# EAGLE schematic iMX233-OLinuXino_Maxi_Rev_B (EAGLE 4.16)
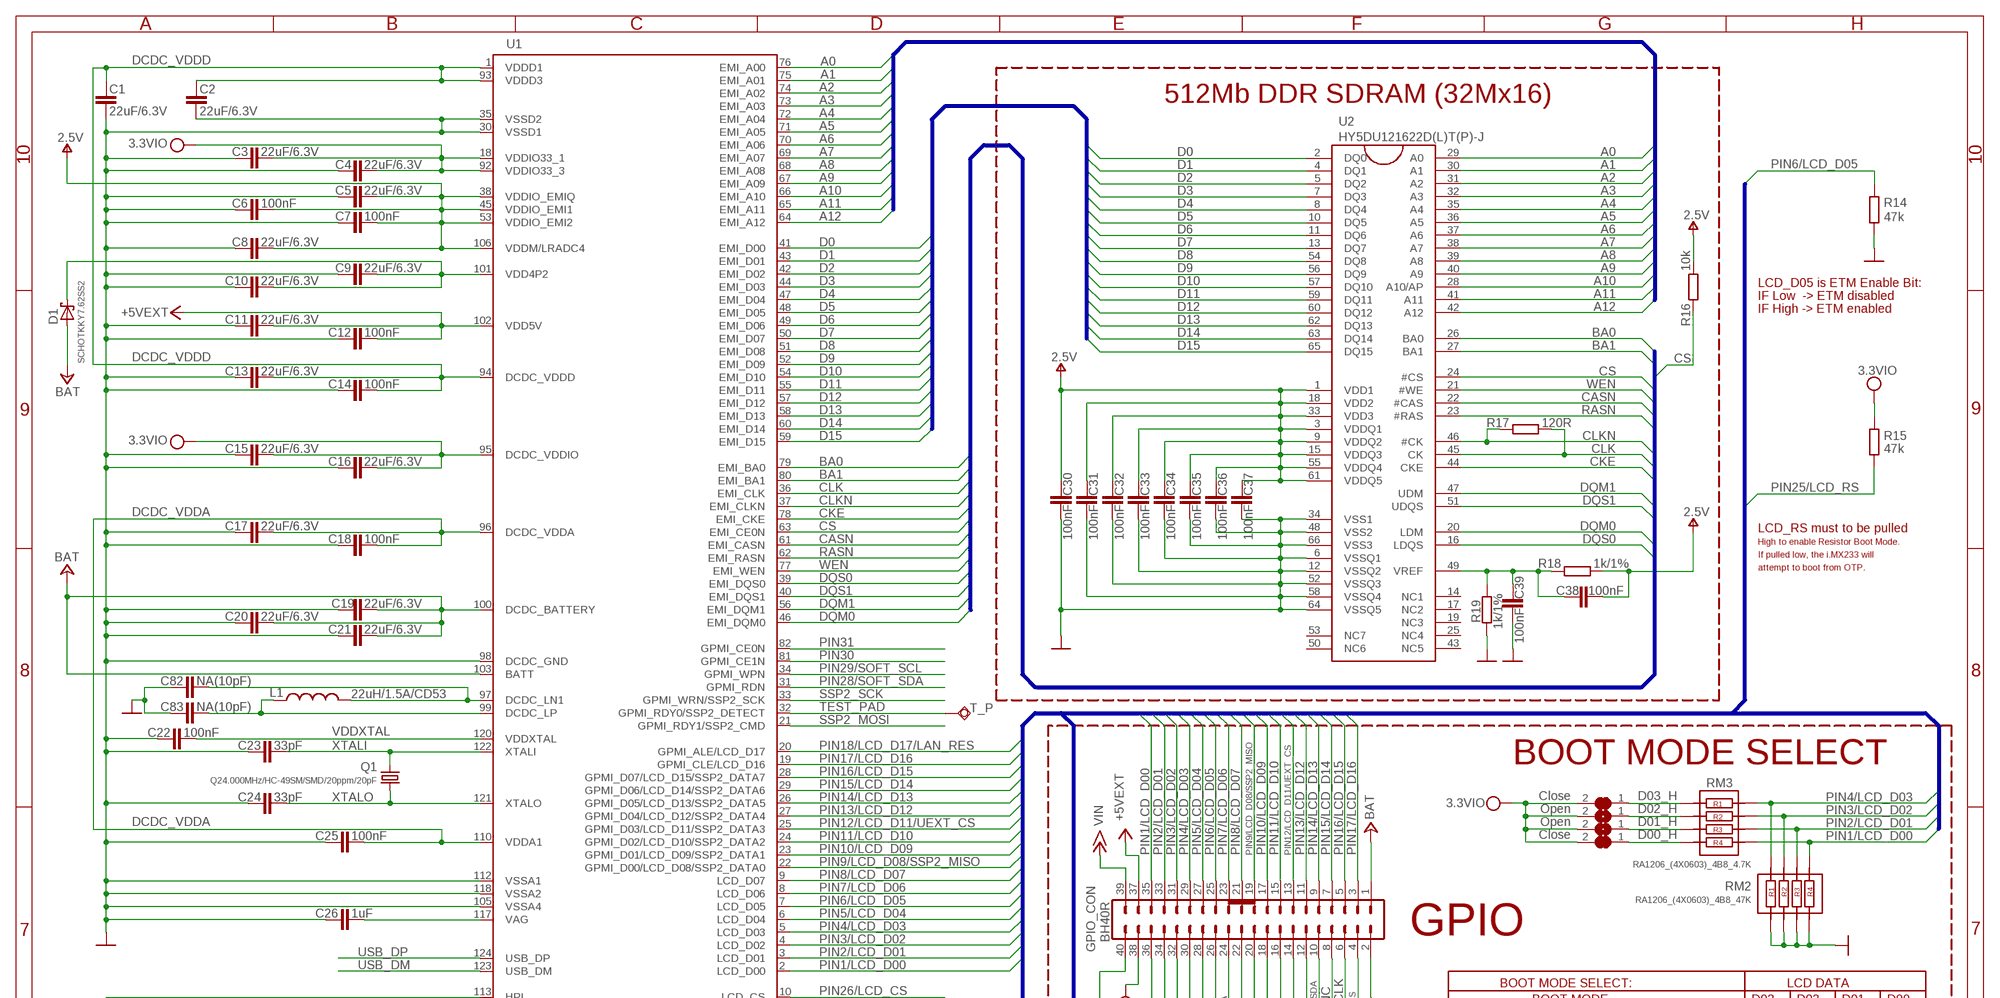
[diagram p0: schematic, sheet 1, part 1 of 2]
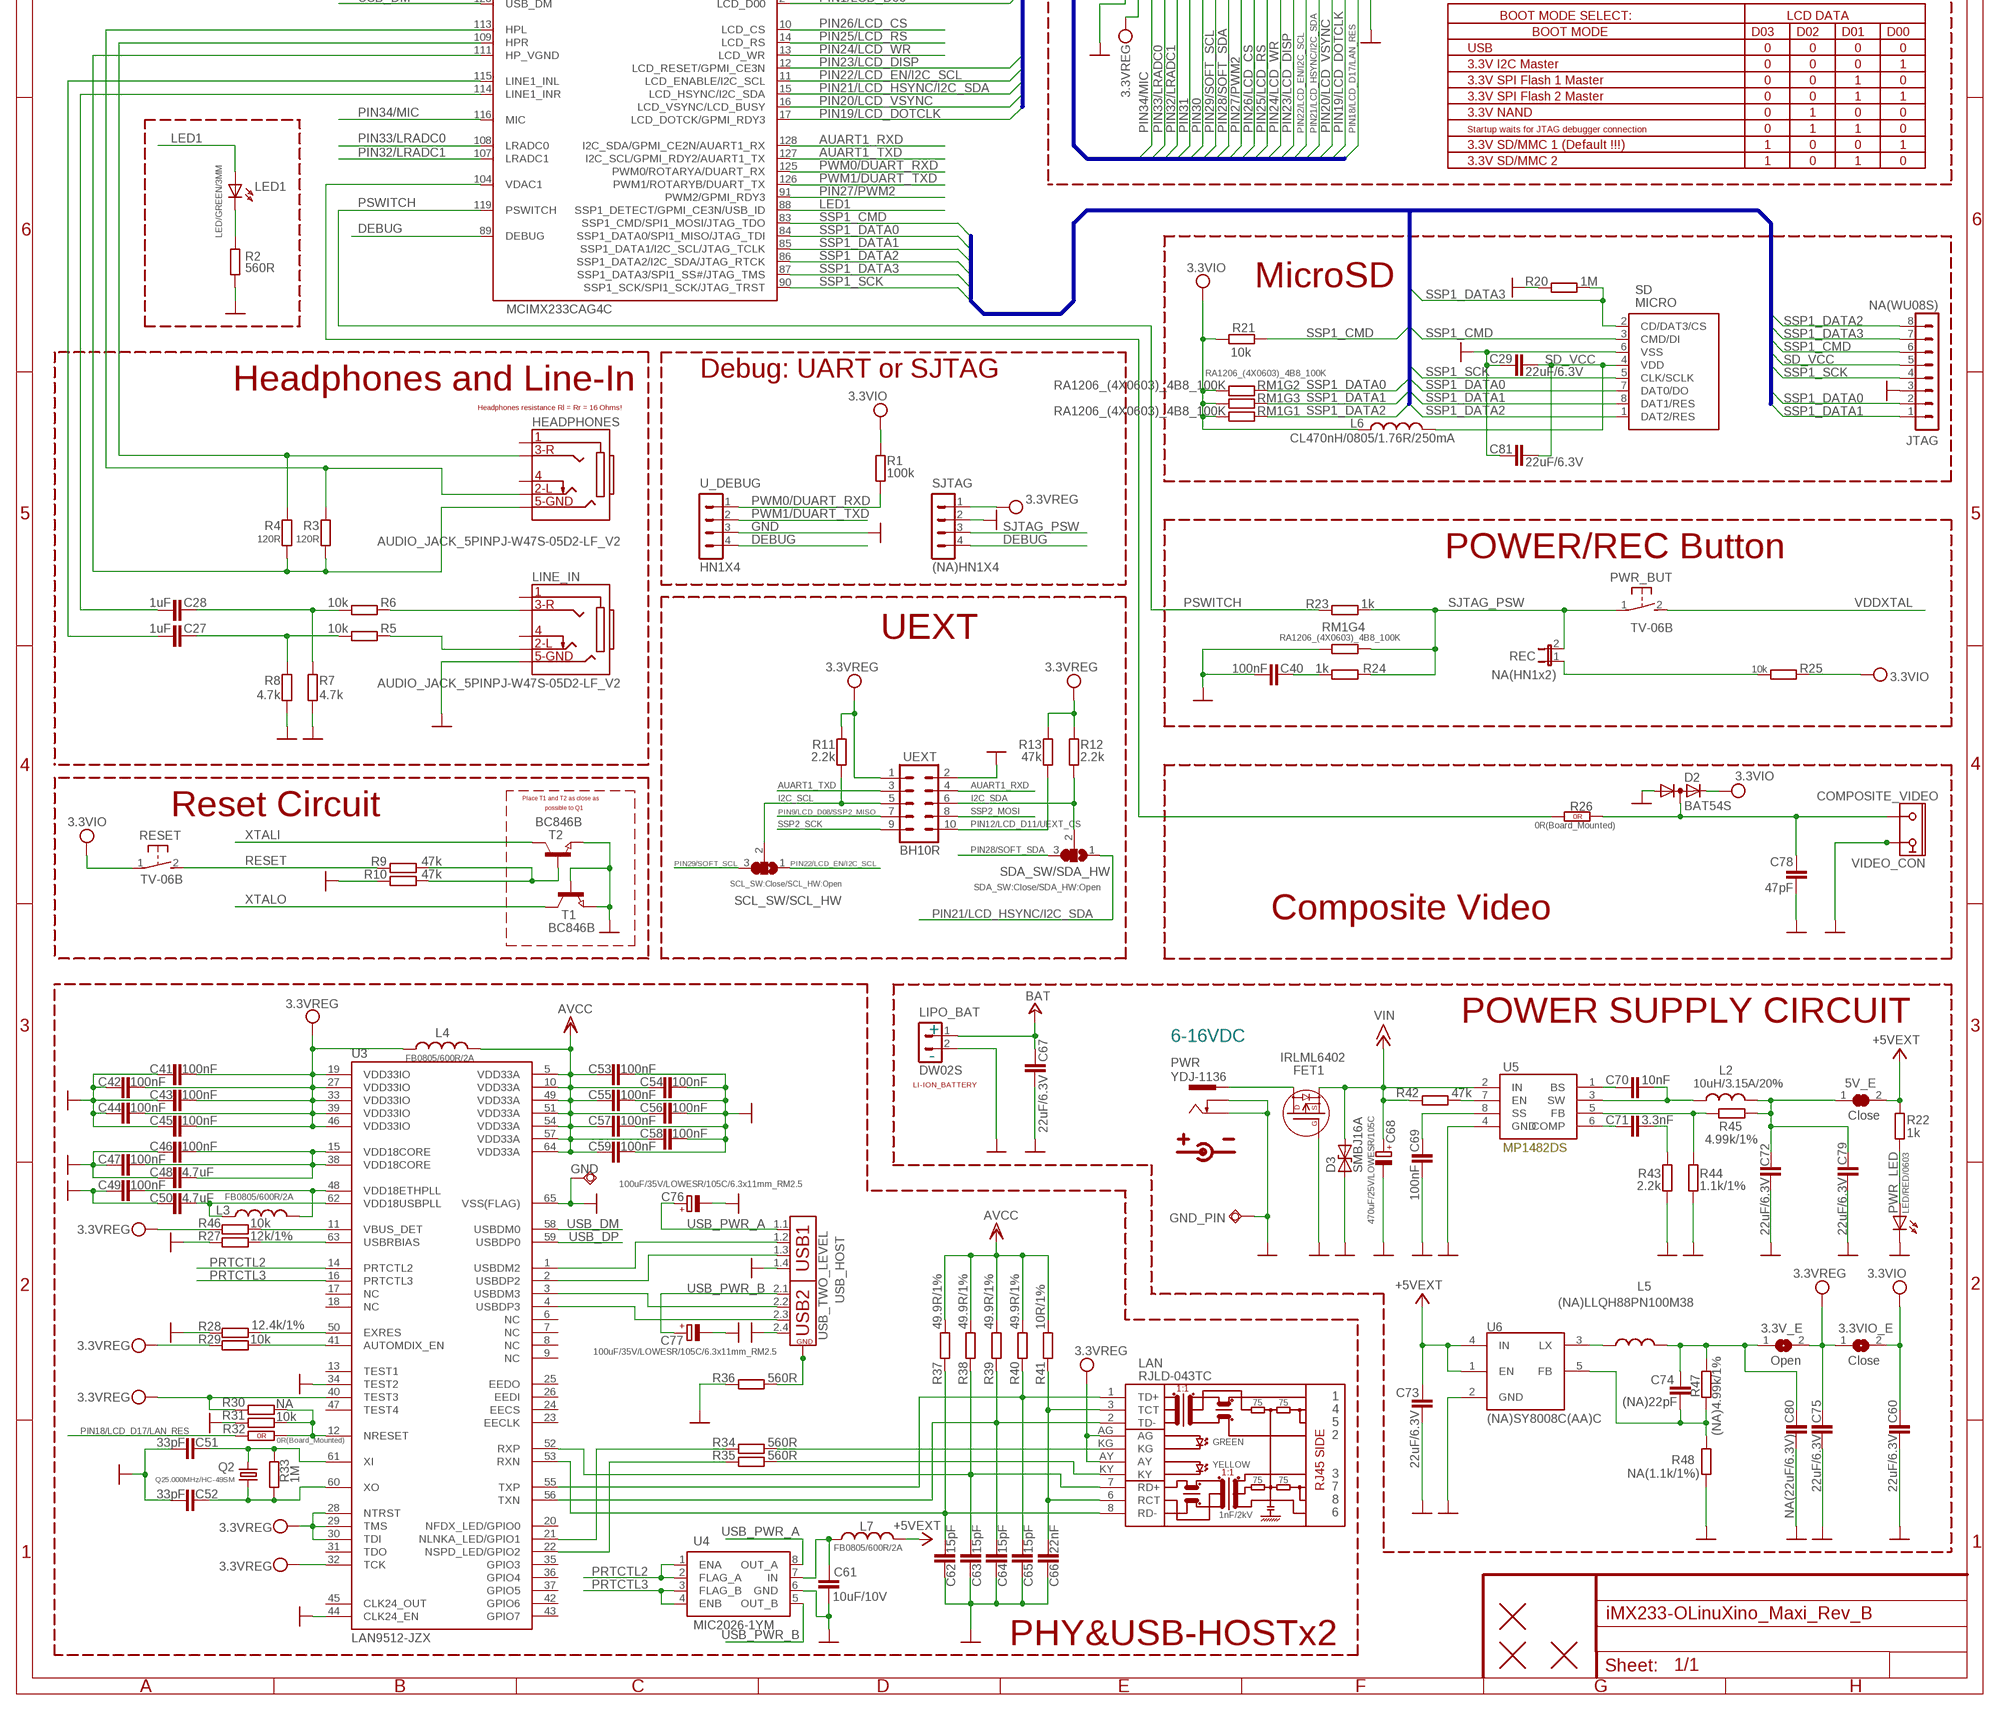
[diagram p1: schematic, sheet 1, part 2 of 2]

## Parts
3.3V_E  Open  SJSJ_SMALLER  [SJ_1_SMALLER]
3.3VIO_E  Close  SJSJ_SMALLER  [SJ_1_SMALLER]
5V_E  Close  SJSJ_1_SMALLER_CLOSE  [SJ_1_SMALLER_CLOSE]
C1  22uF/6.3V  C-EUC0805_5MIL_DWS  [C0805_5MIL_DWS]
C2  22uF/6.3V  C-EUC0805_5MIL_DWS  [C0805_5MIL_DWS]
C3  22uF/6.3V  C-EUC0805_5MIL_DWS  [C0805_5MIL_DWS]
C4  22uF/6.3V  C-EUC0805_5MIL_DWS  [C0805_5MIL_DWS]
C5  22uF/6.3V  C-EUC0805_5MIL_DWS  [C0805_5MIL_DWS]
C6  100nF  C-EUC0603_DWS  [C0603_DWS]
C7  100nF  C-EUC0603_DWS  [C0603_DWS]
C8  22uF/6.3V  C-EUC0805_5MIL_DWS  [C0805_5MIL_DWS]
C9  22uF/6.3V  C-EUC0805_5MIL_DWS  [C0805_5MIL_DWS]
C10  22uF/6.3V  C-EUC0805_5MIL_DWS  [C0805_5MIL_DWS]
C11  22uF/6.3V  C-EUC0805_5MIL_DWS  [C0805_5MIL_DWS]
C12  100nF  C-EUC0603_DWS  [C0603_DWS]
C13  22uF/6.3V  C-EUC0805_5MIL_DWS  [C0805_5MIL_DWS]
C14  100nF  C-EUC0603_DWS  [C0603_DWS]
C15  22uF/6.3V  C-EUC0805_5MIL_DWS  [C0805_5MIL_DWS]
C16  22uF/6.3V  C-EUC0805_5MIL_DWS  [C0805_5MIL_DWS]
C17  22uF/6.3V  C-EUC0805_5MIL_DWS  [C0805_5MIL_DWS]
C18  100nF  C-EUC0603_DWS  [C0603_DWS]
C19  22uF/6.3V  C-EUC0805_5MIL_DWS  [C0805_5MIL_DWS]
C20  22uF/6.3V  C-EUC0805_5MIL_DWS  [C0805_5MIL_DWS]
C21  22uF/6.3V  C-EUC0805_5MIL_DWS  [C0805_5MIL_DWS]
C22  100nF  C-EUC0603_DWS  [C0603_DWS]
C23  33pF  C-EUC0603_DWS  [C0603_DWS]
C24  33pF  C-EUC0603_DWS  [C0603_DWS]
C25  100nF  C-EUC0603_DWS  [C0603_DWS]
C26  1uF  C-EUC0603_DWS  [C0603_DWS]
C27  1uF  C-EUC0603_DWS  [C0603_DWS]
C28  1uF  C-EUC0603_DWS  [C0603_DWS]
C29  22uF/6.3V  C-EUC0805_5MIL_DWS  [C0805_5MIL_DWS]
C30  100nF  C-EUC0603_DWS  [C0603_DWS]
C31  100nF  C-EUC0603_DWS  [C0603_DWS]
C32  100nF  C-EUC0603_DWS  [C0603_DWS]
C33  100nF  C-EUC0603_DWS  [C0603_DWS]
C34  100nF  C-EUC0603_DWS  [C0603_DWS]
C35  100nF  C-EUC0603_DWS  [C0603_DWS]
C36  100nF  C-EUC0603_DWS  [C0603_DWS]
C37  100nF  C-EUC0603_DWS  [C0603_DWS]
C38  100nF  C-EUC0603_DWS  [C0603_DWS]
C39  100nF  C-EUC0603_DWS  [C0603_DWS]
C40  100nF  C-EUC0603_DWS  [C0603_DWS]
C41  100nF  C-EUC0603_DWS  [C0603_DWS]
C42  100nF  C-EUC0603_DWS  [C0603_DWS]
C43  100nF  C-EUC0603_DWS  [C0603_DWS]
C44  100nF  C-EUC0603_DWS  [C0603_DWS]
C45  100nF  C-EUC0603_DWS  [C0603_DWS]
C46  100nF  C-EUC0603_DWS  [C0603_DWS]
C47  100nF  C-EUC0603_DWS  [C0603_DWS]
C48  4.7uF  C-EUC0603_DWS  [C0603_DWS]
C49  100nF  C-EUC0603_DWS  [C0603_DWS]
C50  4.7uF  C-EUC0603_DWS  [C0603_DWS]
C51  33pF  C-EUC0603_DWS  [C0603_DWS]
C52  33pF  C-EUC0603_DWS  [C0603_DWS]
C53  100nF  C-EUC0603_DWS  [C0603_DWS]
C54  100nF  C-EUC0603_DWS  [C0603_DWS]
C55  100nF  C-EUC0603_DWS  [C0603_DWS]
C56  100nF  C-EUC0603_DWS  [C0603_DWS]
C57  100nF  C-EUC0603_DWS  [C0603_DWS]
C58  100nF  C-EUC0603_DWS  [C0603_DWS]
C59  100nF  C-EUC0603_DWS  [C0603_DWS]
C60  22uF/6.3V  C-EUC0805_5MIL_DWS  [C0805_5MIL_DWS]
C61  10uF/10V  C-EUC0603_DWS  [C0603_DWS]
C62  15pF  C-EUC0603_DWS  [C0603_DWS]
C63  15pF  C-EUC0603_DWS  [C0603_DWS]
C64  15pF  C-EUC0603_DWS  [C0603_DWS]
C65  15pF  C-EUC0603_DWS  [C0603_DWS]
C66  22nF  C-EUC0603_DWS  [C0603_DWS]
C67  22uF/6.3V  C-EUC0805_5MIL_DWS  [C0805_5MIL_DWS]
C68  470uF/25V/LOWESR/105C  CPOL-EUE5-10.5  [E5-10,5]
C69  100nF  C-EUC0603_DWS  [C0603_DWS]
C70  10nF  C-EUC0603_DWS  [C0603_DWS]
C71  3.3nF  C-EUC0603_DWS  [C0603_DWS]
C72  22uF/6.3V  C-EUC0805_5MIL_DWS  [C0805_5MIL_DWS]
C73  22uF/6.3V  C-EUC0805_5MIL_DWS  [C0805_5MIL_DWS]
C74  (NA)22pF  C-EUC0603_DWS  [C0603_DWS]
C75  22uF/6.3V  C-EUC0805_5MIL_DWS  [C0805_5MIL_DWS]
C76  100uF/35V/LOWESR/105C/6.3x11mm_RM2.5  CPOL-EUE2.5-6.3  [E2,5-6,3]
C77  100uF/35V/LOWESR/105C/6.3x11mm_RM2.5  CPOL-EUE2.5-6.3  [E2,5-6,3]
C78  47pF  C-EUC0603_DWS  [C0603_DWS]
C79  22uF/6.3V  C-EUC0805_5MIL_DWS  [C0805_5MIL_DWS]
C80  NA(22uF/6.3V)  C-EUC0805_5MIL_DWS  [C0805_5MIL_DWS]
C81  22uF/6.3V  C-EUC0805_5MIL_DWS  [C0805_5MIL_DWS]
C82  NA(10pF)  C-EUC0603_DWS  [C0603_DWS]
C83  NA(10pF)  C-EUC0603_DWS  [C0603_DWS]
COMPOSITE_VIDEO  VIDEO_CON  VIDEO_CON1  [VIDEO_CON]
D00_H  Close  SJSJ_SMALLER  [SJ_1_SMALLER]
D1  SCHOTKKY7.62SS2  [MLL-41]
D01_H  Open  SJSJ_SMALLER  [SJ_1_SMALLER]
D2  BAT54S  DIODE_AC-AC_  [SOT23C(BAT54S)]
D02_H  Open  SJSJ_SMALLER  [SJ_1_SMALLER]
D3  SMBJ16A  SMBJ15A  [DO214AA]
D03_H  Close  SJSJ_SMALLER  [SJ_1_SMALLER]
FET1  IRLML6402  P-MOS+DIODIRLML6402  [SOT23]
GND  TESTPADTESTPAD60/90_WITHOUT_MASK  [TESTPAD60/90_WITHOUT_MASK]
GND_PIN  TESTPAD3  [TEST_PAD40/70/SQUARE]
GPIO_CON  BH40R  ML40R  [BH40R]
HEADPHONES  AUDIO_JACK_5PINPJ-W47S-05D2-LF_V2  [PJ-W47S-05D2-LF_5PIN_V2]
JTAG  NA(WU08S)  CON8WU08S  [WU08S]
L1  22uH/1.5A/CD53  L-USL_CD53  [CD53]
L2  10uH/3.15A/20%  LLQH88PN100M38  [8X8MM_3131]
L3  FB0805/600R/2A  L-USL0805_5MIL_DWS  [L0805_5MIL_DWS]
L4  FB0805/600R/2A  L-USL0805_5MIL_DWS  [L0805_5MIL_DWS]
L5  (NA)LLQH88PN100M38  LLQH88PN100M38  [8X8MM_3131]
L6  CL470nH/0805/1.76R/250mA  L-USL0805_5MIL_DWS  [L0805_5MIL_DWS]
L7  FB0805/600R/2A  L-USL0805_5MIL_DWS  [L0805_5MIL_DWS]
LAN  RJLD-043TC  [RJLD-043TC_PACK]
LED1  LED/GREEN/3MM  LED3.0MM  [LED-3.0MM]
LINE_IN  AUDIO_JACK_5PINPJ-W47S-05D2-LF_V2  [PJ-W47S-05D2-LF_5PIN_V2]
LIPO_BAT  DW02S  CON2DW02S  [DW02S]
PWR  YDJ-1136  PWR-JAKPWR_JACK_UNI_MILLING  [PWR_JACK_UNI_MILLING]
PWR_BUT  TV-06B  31-XX  [B3F-31XX]
PWR_LED  LED/RED/0603  LED0603DWS  [LED-0603]
Q1  Q24.000MHz/HC-49SM/SMD/20ppm/20pF  HC49/S1  [HC49/SMD2_THIN]
Q2  Q25.000MHz/HC-49SM  HC49/S1  [HC49/SMD2_THIN]
R1  100k  R-EU_R0603_5MIL_DWS  [R0603_5MIL_DWS]
R2  560R  R-EU_R0603_5MIL_DWS  [R0603_5MIL_DWS]
R3  120R  R-EU_R0603_5MIL_DWS  [R0603_5MIL_DWS]
R4  120R  R-EU_R0603_5MIL_DWS  [R0603_5MIL_DWS]
R5  10k  R-EU_R0603_5MIL_DWS  [R0603_5MIL_DWS]
R6  10k  R-EU_R0603_5MIL_DWS  [R0603_5MIL_DWS]
R7  4.7k  R-EU_R0603_5MIL_DWS  [R0603_5MIL_DWS]
R8  4.7k  R-EU_R0603_5MIL_DWS  [R0603_5MIL_DWS]
R9  47k  R-EU_R0603_5MIL_DWS  [R0603_5MIL_DWS]
R10  47k  R-EU_R0603_5MIL_DWS  [R0603_5MIL_DWS]
R11  2.2k  R-EU_R0603_5MIL_DWS  [R0603_5MIL_DWS]
R12  2.2k  R-EU_R0603_5MIL_DWS  [R0603_5MIL_DWS]
R13  47k  R-EU_R0603_5MIL_DWS  [R0603_5MIL_DWS]
R14  47k  R-EU_R0603_5MIL_DWS  [R0603_5MIL_DWS]
R15  47k  R-EU_R0603_5MIL_DWS  [R0603_5MIL_DWS]
R16  10k  R-EU_R0603_5MIL_DWS  [R0603_5MIL_DWS]
R17  120R  R-EU_R0603_5MIL_DWS  [R0603_5MIL_DWS]
R18  1k/1%  R-EU_R0603_5MIL_DWS  [R0603_5MIL_DWS]
R19  1k/1%  R-EU_R0603_5MIL_DWS  [R0603_5MIL_DWS]
R20  1M  R-EU_R0603_5MIL_DWS  [R0603_5MIL_DWS]
R21  10k  R-EU_R0603_5MIL_DWS  [R0603_5MIL_DWS]
R22  1k  R-EU_R0603_5MIL_DWS  [R0603_5MIL_DWS]
R23  1k  R-EU_R0603_5MIL_DWS  [R0603_5MIL_DWS]
R24  1k  R-EU_R0603_5MIL_DWS  [R0603_5MIL_DWS]
R25  10k  R-EU_R0603_5MIL_DWS_NA  [R0603_5MIL_DWS_NA]
R26  0R(Board_Mounted)  R_0R0R(NA)  [0603_0R]
R27  12k/1%  R-EU_R0603_5MIL_DWS  [R0603_5MIL_DWS]
R28  12.4k/1%  R-EU_R0603_5MIL_DWS  [R0603_5MIL_DWS]
R29  10k  R-EU_R0603_5MIL_DWS  [R0603_5MIL_DWS]
R30  NA  R-EU_R0603_5MIL_DWS  [R0603_5MIL_DWS]
R31  10k  R-EU_R0603_5MIL_DWS  [R0603_5MIL_DWS]
R32  0R(Board_Mounted)  R_0R0R(NA)  [0603_0R]
R33  1M  R-EU_R0603_5MIL_DWS  [R0603_5MIL_DWS]
R34  560R  R-EU_R0603_5MIL_DWS  [R0603_5MIL_DWS]
R35  560R  R-EU_R0603_5MIL_DWS  [R0603_5MIL_DWS]
R36  560R  R-EU_R0603_5MIL_DWS  [R0603_5MIL_DWS]
R37  49.9R/1%  R-EU_R0603_5MIL_DWS  [R0603_5MIL_DWS]
R38  49.9R/1%  R-EU_R0603_5MIL_DWS  [R0603_5MIL_DWS]
R39  49.9R/1%  R-EU_R0603_5MIL_DWS  [R0603_5MIL_DWS]
R40  49.9R/1%  R-EU_R0603_5MIL_DWS  [R0603_5MIL_DWS]
R41  10R/1%  R-EU_R0603_5MIL_DWS  [R0603_5MIL_DWS]
R42  47k  R-EU_R0603_5MIL_DWS  [R0603_5MIL_DWS]
R43  2.2k  R-EU_R0603_5MIL_DWS  [R0603_5MIL_DWS]
R44  1.1k/1%  R-EU_R0603_5MIL_DWS  [R0603_5MIL_DWS]
R45  4.99k/1%  R-EU_R0603_5MIL_DWS  [R0603_5MIL_DWS]
R46  10k  R-EU_R0603_5MIL_DWS  [R0603_5MIL_DWS]
R47  (NA)4.99k/1%  R-EU_R0603_5MIL_DWS  [R0603_5MIL_DWS]
R48  NA(1.1k/1%)  R-EU_R0603_5MIL_DWS  [R0603_5MIL_DWS]
REC  NA(HN1x2)  JP1E  [JP1]
RESET  TV-06B  31-XX  [B3F-31XX]
RM1  RA1206_(4X0603)_4B8_100K  R_MATRIX_4E  [R_MATRIX_4]
RM2  RA1206_(4X0603)_4B8_47K  R_MATRIX_4  [R_MATRIX_4]
RM3  RA1206_(4X0603)_4B8_4.7K  R_MATRIX_4  [R_MATRIX_4]
SCL_SW/SCL_HW  SCL_SW:Close/SCL_HW:Open  SJ2W4  [SJ_2_SMALLER]
SD  MICRO  MICRO_SD/MMC  [TFR-MEM-CON]
SDA_SW/SDA_HW  SDA_SW:Close/SDA_HW:Open  SJ2W4  [SJ_2_SMALLER]
SJTAG  (NA)HN1X4  CON4HN1X4  [HN1X4]
T1  BC846B  NPN-TRANSISTOR_SOT23  [SOT23]
T2  BC846B  NPN-TRANSISTOR_SOT23  [SOT23]
T_P  TESTPAD50/40  [SMD50/40]
U1  MCIMX233CAG4C  MCIMX233DAG4B_LD  [TQFP128LD]
U2  HY5DU121622D(L)T(P)-J  [66TSOP-II]
U3  LAN9512-JZX  [QFN64]
U4  MIC2026-1YM  [SO-8]
U5  MP1482DS  MP1482  [SOIC8]
U6  (NA)SY8008C(AA)C  SY8008  [SOT23-5]
U$1  FIDUCIAL1X2  [FIDUCIAL-1X2]
U$2  FIDUCIAL1X2  [FIDUCIAL-1X2]
U$3  FIDUCIAL1X2  [FIDUCIAL-1X2]
U_DEBUG  HN1X4  CON4HN1X4  [HN1X4]
UEXT  BH10R  ML10R  [BH10R]
USB_HOST  USB_TWO_LEVEL  [USB_TWO_LEVEL]

## Nets
+5V: 5V_E.2 C11.2 C12.2 C73.1 GPIO_CON.37 L7.2 R22.1 U1.102(VDD5V) U6.1(EN) U6.4(IN) ; supply symbol labelled +5VEXT
+15V: C68.+ D3.C FET1.2(S) GPIO_CON.39 R42.1 U5.2(IN) ; supply symbol labelled VIN
+24V: C19.2 C20.2 C21.2 C67.2 D1.A GPIO_CON.1 LIPO_BAT.1 U1.100(DCDC_BATTERY) U1.103(BATT) ; supply symbol labelled BAT
A0: U1.76(EMI_A00) U2.29(A0)
A1: U1.75(EMI_A01) U2.30(A1)
A2: U1.74(EMI_A02) U2.31(A2)
A3: U1.73(EMI_A03) U2.32(A3)
A4: U1.72(EMI_A04) U2.35(A4)
A5: U1.71(EMI_A05) U2.36(A5)
A6: U1.70(EMI_A06) U2.37(A6)
A7: U1.69(EMI_A07) U2.38(A7)
A8: U1.68(EMI_A08) U2.39(A8)
A9: U1.67(EMI_A09) U2.40(A9)
A10: U1.66(EMI_A10) U2.28(A10/AP)
A11: U1.65(EMI_A11) U2.41(A11)
A12: U1.64(EMI_A12) U2.42(A12)
AUART1_RXD: U1.128(I2C_SDA/GPMI_CE2N/AUART1_RX) UEXT.4
AUART1_TXD: U1.127(I2C_SCL/GPMI_RDY2/AUART1_TX) UEXT.3
BA0: U1.79(EMI_BA0) U2.26(BA0)
BA1: U1.80(EMI_BA1) U2.27(BA1)
CASN: U1.61(EMI_CASN) U2.22(#CAS)
CKE: U1.78(EMI_CKE) U2.44(CKE)
CLK: R17.2 U1.36(EMI_CLK) U2.45(CK)
CLKN: R17.1 U1.37(EMI_CLKN) U2.46(#CK)
CS: R16.1 U1.63(EMI_CE0N) U2.24(#CS)
D0: U1.41(EMI_D00) U2.2(DQ0)
D1: U1.43(EMI_D01) U2.4(DQ1)
D2: U1.42(EMI_D02) U2.5(DQ2)
D3: U1.44(EMI_D03) U2.7(DQ3)
D4: U1.47(EMI_D04) U2.8(DQ4)
D5: U1.48(EMI_D05) U2.10(DQ5)
D6: U1.49(EMI_D06) U2.11(DQ6)
D7: U1.50(EMI_D07) U2.13(DQ7)
D8: U1.51(EMI_D08) U2.54(DQ8)
D9: U1.52(EMI_D09) U2.56(DQ9)
D10: U1.54(EMI_D10) U2.57(DQ10)
D11: U1.55(EMI_D11) U2.59(DQ11)
D12: U1.57(EMI_D12) U2.60(DQ12)
D13: U1.58(EMI_D13) U2.62(DQ13)
D14: U1.60(EMI_D14) U2.63(DQ14)
D15: U1.59(EMI_D15) U2.65(DQ15)
DCDC_VDDA: C17.2 C18.2 C25.2 U1.96(DCDC_VDDA) U1.110(VDDA1)
DCDC_VDDD: C1.2 C2.2 C13.2 C14.2 U1.1(VDDD1) U1.93(VDDD3) U1.94(DCDC_VDDD)
DEBUG: SJTAG.4 U1.89(DEBUG) U_DEBUG.4
DQM0: U1.46(EMI_DQM0) U2.20(LDM)
DQM1: U1.56(EMI_DQM1) U2.47(UDM)
DQS0: U1.39(EMI_DQS0) U2.16(LDQS)
DQS1: U1.40(EMI_DQS1) U2.51(UDQS)
GND [PWR]: C1.1 C2.1 C3.1 C4.1 C5.1 C6.1 C7.1 C8.1 C9.1 C10.1 C11.1 C12.1 C13.1 C14.1 C15.1 C16.1 C17.1 C18.1 C19.1 C20.1 C21.1 C22.1 C23.1 C24.1 C25.1 C26.1 C29.1 C30.1 C31.1 C32.1 C33.1 C34.1 C35.1 C36.1 C37.1 C39.1 C40.2 C41.1 C42.1 C43.1 C44.1 C45.1 C46.1 C47.1 C48.1 C49.1 C50.1 C51.2 C52.2 C53.2 C54.2 C55.2 C56.2 C57.2 C58.2 C59.2 C60.2 C61.2 C62.2 C63.2 C64.2 C65.2 C66.2 C67.1 C68.- C69.2 C72.2 C73.2 C75.2 C76.- C77.- C78.2 C79.2 C80.2 C81.1 C82.1 C83.1 COMPOSITE_VIDEO.GND1(GND) COMPOSITE_VIDEO.GND2(GND) COMPOSITE_VIDEO.GND3(GND) D2.1(A) D3.A FET1.1(G) GND.P$1(PP) GND_PIN.P$1(PP) GPIO_CON.2 GPIO_CON.40 JTAG.3 LINE_IN.5 LIPO_BAT.2 PWR.- PWR.-- PWR_LED.C R2.1 R7.1 R8.1 R10.2 R14.1 R19.1 R20.2 R27.1 R28.1 R31.1 R36.1 R43.2 R44.2 R48.2 RM1.4.1 RM2.1.1 RM2.2.1 RM2.3.1 RM2.4.1 SD.6(VSS) SJTAG.2 T1.1(B) T1.2(E) T2.2(E) U1.30(VSSD1) U1.35(VSSD2) U1.98(DCDC_GND) U1.105(VSSA4) U1.112(VSSA1) U1.118(VSSA2) U2.6(VSSQ1) U2.12(VSSQ2) U2.34(VSS1) U2.48(VSS2) U2.52(VSSQ3) U2.58(VSSQ4) U2.64(VSSQ5) U2.66(VSS3) U3.34(TEST2) U3.44(CLK24_EN) U3.65(VSS(FLAG)) U4.6(GND) U5.4(GND) U6.2(GND) U_DEBUG.3 UEXT.2 USB_HOST.1.4 USB_HOST.2.4
HP_VGND: HEADPHONES.5 R3.1 R4.1 U1.111(HP_VGND)
I2C_SCL: R11.1 SCL_SW/SCL_HW.2 UEXT.5
I2C_SDA: R12.1 SDA_SW/SDA_HW.2 UEXT.6
LED1 [PWR]: LED1.A U1.88(SSP1_DETECT/GPMI_CE3N/USB_ID)
N$1: C61.1 L7.1 U4.7(IN)
N$2: C46.2 C47.2 C48.2 U3.15(VDD18CORE) U3.38(VDD18CORE)
N$3: C49.2 L3.2 U3.48(VDD18ETHPLL)
N$4: C78.1 COMPOSITE_VIDEO.IO D2.3(AK) R26.2(1.2)
N$5: R46.2 U3.11(VBUS_DET)
N$6: LINE_IN.2 R5.2
N$7: C38.2 C39.2 R18.1 R19.2 U2.49(VREF)
N$8: R25.1 REC.1
N$11: C50.2 L3.1 U3.62(VDD18USBPLL)
N$12: R27.2 U3.63(USBRBIAS)
N$15: HEADPHONES.2 R3.2 U1.113(HPL)
N$17: R28.2 U3.50(EXRES)
N$18: C82.2 L1.2 U1.97(DCDC_LN1)
N$19: C83.2 L1.1 U1.99(DCDC_LP)
N$21: HEADPHONES.3 R4.2 U1.109(HPR)
N$23: 5V_E.1 C72.1 C79.1 L2.2 R45.2
N$24: R29.2 U3.41(AUTOMDIX_EN)
N$25: C26.2 U1.117(VAG)
N$29: LINE_IN.3 R6.2
N$30: C51.1 Q2.2 R33.2 U3.61(XI)
N$31: FET1.3(D) PWR.+
N$32: C28.1 R6.1 R7.2
N$33: C27.1 R5.1 R8.2
N$34: C27.2 U1.115(LINE1_INL)
N$35: C28.2 U1.114(LINE1_INR)
N$36: C69.1 U5.8(SS)
N$37: R42.2 U5.7(EN)
N$38: C40.1 R24.1
N$39: C52.1 Q2.1 R33.1 U3.60(XO)
N$40: R34.1 U3.21(NLNKA_LED/GPIO1)
N$41: R35.1 U3.22(NSPD_LED/GPIO2)
N$42: LED1.K(C) R2.2
N$43: R9.1 R10.1 T2.1(B)
N$45: LAN.KG R34.2
N$46: C70.1 U5.1(BS)
N$47: LAN.KY R35.2
N$48: C62.1 LAN.8(RD-) R37.1 U3.53(RXN)
N$49: R30.2 R31.2 R32.2(1.2) U3.12(NRESET)
N$50: C70.2 L2.1 U5.3(SW)
N$51: C63.1 LAN.7(RD+) R38.1 U3.52(RXP)
N$52: C64.1 LAN.2(TD-) R39.1 U3.56(TXN)
N$53: C65.1 LAN.1(TD+) R40.1 U3.55(TXP)
N$54: C66.1 LAN.3(TCT) LAN.6(RCT) R41.1
N$55: U3.1(USBDM2) USB_HOST.1.2
N$56: U3.2(USBDP2) USB_HOST.1.3
N$57: U3.3(USBDM3) USB_HOST.2.2
N$58: U3.4(USBDP3) USB_HOST.2.3
N$59: R36.2 USB_HOST.GND1 USB_HOST.GND2 USB_HOST.GND3 USB_HOST.GND4
N$60: C71.1 U5.6(COMP)
N$61: C71.2 R43.1
N$62: R44.1 R45.1 U5.5(FB)
N$64: L5.1 U6.3(LX)
N$65: 3.3V_E.1 C74.1 C80.1 L5.2 R47.1
N$66: C74.2 R47.2 R48.1 U6.5(FB)
N$101: D03_H.1 RM3.1.2
N$103: D02_H.1 RM3.2.2
N$104: D01_H.1 RM3.3.2
N$105: D00_H.1 RM3.4.2
N$129: PWR_LED.A R22.2
PIN1/LCD_D00: GPIO_CON.35 RM2.4.2 RM3.4.1 U1.2(LCD_D00)
PIN2/LCD_D01: GPIO_CON.33 RM2.3.2 RM3.3.1 U1.3(LCD_D01)
PIN3/LCD_D02: GPIO_CON.31 RM2.2.2 RM3.2.1 U1.4(LCD_D02)
PIN4/LCD_D03: GPIO_CON.29 RM2.1.2 RM3.1.1 U1.5(LCD_D03)
PIN5/LCD_D04: GPIO_CON.27 U1.6(LCD_D04)
PIN6/LCD_D05: GPIO_CON.25 R14.2 U1.7(LCD_D05)
PIN7/LCD_D06: GPIO_CON.23 U1.8(LCD_D06)
PIN8/LCD_D07: GPIO_CON.21 U1.9(LCD_D07)
PIN9/LCD_D08/SSP2_MISO: GPIO_CON.19 U1.22(GPMI_D00/LCD_D08/SSP2_DATA0) UEXT.7
PIN10/LCD_D09: GPIO_CON.17 U1.23(GPMI_D01/LCD_D09/SSP2_DATA1)
PIN11/LCD_D10: GPIO_CON.15 U1.24(GPMI_D02/LCD_D10/SSP2_DATA2)
PIN12/LCD_D11/UEXT_CS: GPIO_CON.13 R13.1 U1.25(GPMI_D03/LCD_D11/SSP2_DATA3) UEXT.10
PIN13/LCD_D12: GPIO_CON.11 U1.27(GPMI_D04/LCD_D12/SSP2_DATA4)
PIN14/LCD_D13: GPIO_CON.9 U1.26(GPMI_D05/LCD_D13/SSP2_DATA5)
PIN15/LCD_D14: GPIO_CON.7 U1.29(GPMI_D06/LCD_D14/SSP2_DATA6)
PIN16/LCD_D15: GPIO_CON.5 U1.28(GPMI_D07/LCD_D15/SSP2_DATA7)
PIN17/LCD_D16: GPIO_CON.3 U1.19(GPMI_CLE/LCD_D16)
PIN18/LCD_D17/LAN_RES: GPIO_CON.4 R32.1(1.1) U1.20(GPMI_ALE/LCD_D17)
PIN19/LCD_DOTCLK: GPIO_CON.6 U1.17(LCD_DOTCK/GPMI_RDY3)
PIN20/LCD_VSYNC: GPIO_CON.8 U1.16(LCD_VSYNC/LCD_BUSY)
PIN21/LCD_HSYNC/I2C_SDA: GPIO_CON.10 SDA_SW/SDA_HW.1 U1.15(LCD_HSYNC/I2C_SDA)
PIN22/LCD_EN/I2C_SCL: GPIO_CON.12 SCL_SW/SCL_HW.1 U1.11(LCD_ENABLE/I2C_SCL)
PIN23/LCD_DISP: GPIO_CON.14 U1.12(LCD_RESET/GPMI_CE3N)
PIN24/LCD_WR: GPIO_CON.16 U1.13(LCD_WR)
PIN25/LCD_RS: GPIO_CON.18 R15.2 U1.14(LCD_RS)
PIN26/LCD_CS: GPIO_CON.20 U1.10(LCD_CS)
PIN27/PWM2 [PWR]: GPIO_CON.22 U1.91(PWM2/GPMI_RDY3)
PIN28/SOFT_SDA: GPIO_CON.24 SDA_SW/SDA_HW.3 U1.31(GPMI_RDN)
PIN29/SOFT_SCL: GPIO_CON.26 SCL_SW/SCL_HW.3 U1.34(GPMI_WPN)
PIN30: GPIO_CON.28 U1.81(GPMI_CE1N)
PIN31: GPIO_CON.30 U1.82(GPMI_CE0N)
PIN32/LRADC1: GPIO_CON.32 U1.107(LRADC1)
PIN33/LRADC0: GPIO_CON.34 U1.108(LRADC0)
PIN34/MIC: GPIO_CON.36 U1.116(MIC)
PRTCTL2: U3.14(PRTCTL2) U4.1(ENA) U4.2(FLAG_A)
PRTCTL3: U3.16(PRTCTL3) U4.3(FLAG_B) U4.4(ENB)
PSWITCH: R23.1 U1.119(PSWITCH)
PWM0/DUART_RXD: R1.1 U1.125(PWM0/ROTARYA/DUART_RX) U_DEBUG.1
PWM1/DUART_TXD: U1.126(PWM1/ROTARYB/DUART_TX) U_DEBUG.2
RASN: U1.62(EMI_RASN) U2.23(#RAS)
RESET: R9.2 RESET.2(S)
SD_VCC: C29.2 C81.2 JTAG.5 L6.2 SD.4(VDD)
SJTAG_PSW: PWR_BUT.1(P) R23.2 R24.2 REC.2 RM1.4.2 SJTAG.3
SSP1_CMD: JTAG.6 R21.1 SD.3(CMD/DI) U1.83(SSP1_CMD/SPI1_MOSI/JTAG_TDO)
SSP1_DATA0: JTAG.2 RM1.2.1 SD.7(DAT0/DO) U1.84(SSP1_DATA0/SPI1_MISO/JTAG_TDI)
SSP1_DATA1: JTAG.1 RM1.3.1 SD.8(DAT1/RES) U1.85(SSP1_DATA1/I2C_SCL/JTAG_TCLK)
SSP1_DATA2: JTAG.8 RM1.1.1 SD.1(DAT2/RES) U1.86(SSP1_DATA2/I2C_SDA/JTAG_RTCK)
SSP1_DATA3: JTAG.7 R20.1 SD.2(CD/DAT3/CS) U1.87(SSP1_DATA3/SPI1_SS#/JTAG_TMS)
SSP1_SCK: JTAG.4 SD.5(CLK/SCLK) U1.90(SSP1_SCK/SPI1_SCK/JTAG_TRST)
SSP2_MOSI: U1.21(GPMI_RDY1/SSP2_CMD) UEXT.8
SSP2_SCK: U1.33(GPMI_WRN/SSP2_SCK) UEXT.9
TEST_PAD: T_P.P$1(PP) U1.32(GPMI_RDY0/SSP2_DETECT)
USB_DM: U1.123(USB_DM) U3.58(USBDM0)
USB_DP: U1.124(USB_DP) U3.59(USBDP0)
USB_PWR_A: C76.+ U4.8(OUT_A) USB_HOST.1.1
USB_PWR_B: C77.+ U4.5(OUT_B) USB_HOST.2.1
V+: C5.2 C6.2 C7.2 C8.2 C30.2 C31.2 C32.2 C33.2 C34.2 C35.2 C36.2 C37.2 C38.1 R16.2 R18.2 U1.38(VDDIO_EMIQ) U1.45(VDDIO_EMI1) U1.53(VDDIO_EMI2) U1.106(VDDM/LRADC4) U2.1(VDD1) U2.3(VDDQ1) U2.9(VDDQ2) U2.15(VDDQ3) U2.18(VDD2) U2.33(VDD3) U2.55(VDDQ4) U2.61(VDDQ5) ; supply symbol labelled 2.5V
VCC [PWR]: 3.3V_E.2 3.3VIO_E.1 C41.2 C42.2 C43.2 C44.2 C45.2 C75.1 GPIO_CON.38 L4.1 LAN.AG LAN.AY R11.2 R12.2 R13.2 R29.1 R30.1 R46.1 SJTAG.1 U3.19(VDD33IO) U3.27(VDD33IO) U3.28(NTRST) U3.29(TMS) U3.30(TDI) U3.32(TCK) U3.33(VDD33IO) U3.39(VDD33IO) U3.40(TEST3) U3.46(VDD33IO) UEXT.1 ; supply symbol labelled 3.3VREG
VDAC1: R26.1(1.1) U1.104(VDAC1)
VDD: C53.1 C54.1 C55.1 C56.1 C57.1 C58.1 C59.1 L4.2 R37.2 R38.2 R39.2 R40.2 R41.2 U3.5(VDD33A) U3.10(VDD33A) U3.49(VDD33A) U3.51(VDD33A) U3.54(VDD33A) U3.57(VDD33A) U3.64(VDD33A) ; supply symbol labelled AVCC
VDD4P2: C9.2 C10.2 D1.K(C) U1.101(VDD4P2)
VDDXTAL: C22.2 PWR_BUT.2(S) U1.120(VDDXTAL)
VPP [PWR]: 3.3VIO_E.2 C3.2 C4.2 C15.2 C16.2 C60.1 D00_H.2 D01_H.2 D2.2(K) D02_H.2 D03_H.2 L6.1 R1.2 R15.1 R21.2 R25.2 RESET.1(P) RM1.1.2 RM1.2.2 RM1.3.2 U1.18(VDDIO33_1) U1.92(VDDIO33_3) U1.95(DCDC_VDDIO) ; supply symbol labelled 3.3VIO
WEN: U1.77(EMI_WEN) U2.21(#WE)
XTALI: C23.2 Q1.2 T2.3(C) U1.122(XTALI)
XTALO: C24.2 Q1.1 T1.3(C) U1.121(XTALO)
Unconnected: HEADPHONES.1 HEADPHONES.4 LINE_IN.1 LINE_IN.4 U2.14(NC1) U2.17(NC2) U2.19(NC3) U2.25(NC4) U2.43(NC5) U2.50(NC6) U2.53(NC7) U3.6(NC) U3.7(NC) U3.8(NC) U3.9(NC) U3.13(TEST1) U3.17(NC) U3.18(NC) U3.20(NFDX_LED/GPIO0) U3.23(EECLK) U3.24(EECS) U3.25(EEDO) U3.26(EEDI) U3.31(TDO) U3.35(GPIO3) U3.36(GPIO4) U3.37(GPIO5) U3.42(GPIO6) U3.43(GPIO7) U3.45(CLK24_OUT) U3.47(TEST4)

## Buses
A[0..12]
D[0..15]
SSP1_CMD/SPI1_MOSI,SSP1_DATA0/SPI1_MISO,SSP1_SCK/SPI1_SCK,SSP1_DATA3/SPI1_SS#,SSP1_DATA1/I2C_SCL,SSP1_DATA2/I2C_SDA
LCD_D17,LCD_D16,LCD_D15,LCD_D14,LCD_D13,LCD_D12,LCD_D11,LCD_D10,LCD_D09,LCD_D08/SSP2_MISO,LCD_D07,LCD_D06,LCD_D05,LCD_D04,LCD_D03,LCD_D02,LCD_D01,LCD_D00,LCD_DOTCLK,LCD_VSYNC,LCD_HSYNC/I2C_SDA,LCD_EN/I2C_SCL,LCD_DISP
BA[0..1],CLK,CLKN,CKE,CS,CASN,RASN,WEN,DQM[0..1],DQS[0..1]

## Notes on the sheet
- 512Mb DDR SDRAM (32Mx16)
- LCD_D05 is ETM Enable Bit:
- IF Low  -> ETM disabled
- IF High -> ETM enabled
- LCD_RS must to be pulled
- High to enable Resistor Boot Mode.
- If pulled low, the i.MX233 will
- attempt to boot from OTP.
- BOOT MODE SELECT
- GPIO
- BOOT MODE SELECT: | LCD DATA
- BOOT MODE | D03 | D02 | D01 | D00
- USB | 0 | 0 | 0 | 0
- 3.3V I2C Master | 0 | 0 | 0 | 1
- 3.3V SPI Flash 1 Master | 0 | 0 | 1 | 0
- 3.3V SPI Flash 2 Master | 0 | 0 | 1 | 1
- 3.3V NAND | 0 | 1 | 0 | 0
- Startup waits for JTAG debugger connection | 0 | 1 | 1 | 0
- 3.3V SD/MMC 1 (Default !!!) | 1 | 0 | 0 | 1
- 3.3V SD/MMC 2 | 1 | 0 | 1 | 0
- MicroSD
- Debug: UART or SJTAG
- Headphones and Line-In
- Headphones resistance Rl = Rr = 16 Ohms!
- POWER/REC Button
- UEXT
- Place T1 and T2 as close as
- possible to Q1
- Reset Circuit
- Composite Video
- POWER SUPPLY CIRCUIT
- +
- 6-16VDC
- -
- LI-ION_BATTERY
- PHY&USB-HOSTx2

## Library data of the parts
3.3V_E 3.3VIO_E 5V_E D00_H D01_H D02_H D03_H = jumper:SJ: SMD solder JUMPER
C1-C67 C69-C75 C78-C83 = rcl:C-EU: CAPACITOR, European symbol
C68 C76 C77 = rcl:CPOL-EU: POLARIZED CAPACITOR, European symbol
COMPOSITE_VIDEO = OLIMEX_CONNECTORS:VIDEO_CON
D1 = gogo:SCHOTKKY7.62SS
D2 = semicon-smd-ipc:DIODE_AC-AC_: DUAL DIODE
D3 = OLIMEX_DISCRET:SMBJ15A
FET1 = Penko:P-MOS+DIOD
GND GND_PIN T_P = gogo:TESTPAD: drill 40mils, diameter 70mils
GPIO_CON = con-harting-ml:ML40: HARTING
HEADPHONES LINE_IN = gogo:AUDIO_JACK_5PIN
JTAG = Penko:CON8
L1 L3 L4 L6 L7 = rcl:L-US: INDUCTOR, American symbol
L2 L5 = OLIMEX_DISCRET:L
LAN = OLIMEX_CONNECTORS:RJLD-043TC
LED1 PWR_LED = DOUBLE-SIDE:LED
LIPO_BAT = Penko:CON2
PWR = gogo:PWR-JAK
PWR_BUT RESET = switch-omron:31-XX: OMRON SWITCH
Q1 Q2 = crystal:HC49/S: CRYSTAL
R1-R25 R27-R31 R33-R48 = rcl:R-EU_: RESISTOR, European symbol
R26 R32 = OLIMEX_DISCRET:R_0R
REC = jumper:JP1E: JUMPER
RM1 = OLIMEX_DISCRET:R_MATRIX_4E
RM2 RM3 = OLIMEX_DISCRET:R_MATRIX_4
SCL_SW/SCL_HW SDA_SW/SDA_HW = jumper:SJ2W: SMD solder JUMPER
SD = OLIMEX_CONNECTORS:MICRO_SD/MMC
SJTAG U_DEBUG = Penko:CON4
T1 T2 = semicon-smd-ipc:NPN-TRANSISTOR_: NPN TRANSISTOR
U1 = OLIMEX_IC:MCIMX233DAG4B: i.MX23
U2 = OLIMEX_IC:HY5DU121622D(L)T(P)
U3 = OLIMEX_IC:LAN9512-JZX
U4 = OLIMEX_IC:MIC2026: LM3526 Dual Port USB Power Switch and Over-Current Protection Features: -> Compatible with USB1.1 and USB2.0; -> 1 ms fault flag delay filters Hot-Plug events; -> Smooth turn-on eliminates in-rush induced voltage drop; -> UL recognized component: REF#205202; -> 1A nominal shortcircuit output current protects PC power supplies; -> Thermal shutdown protects device in direct short condition; -> 500mA minimum continuous load current; -> Small SO-8 package minimizes board space; -> 2.7V to 5.5V input voltage range; -> 140mOhm Max.switch resistance; -> 1 µA Max. standby current; -> 200µA Max. operating current; -> Under-voltage lockout(UVLO);
U5 = OLIMEX_IC:MP1482
U6 = OLIMEX_IC:SY8008
U$1-U$3 = SparkFunEagle-6-6-07:FIDUCIAL: Fiducial Alignment Points Various fiducial points for machine vision alignment.
UEXT = con-harting-ml:ML10: HARTING
USB_HOST = OLIMEX_CONNECTORS:USB_TWO_LEVEL

## Net classes
1 PWR: width 0.203 mm, drill 0.076 mm, clearance 0.4 mm